# Altium schematic sheet 01-Cover page.SchDoc
size A3; SheetNumber: 1; SheetTotal: 3
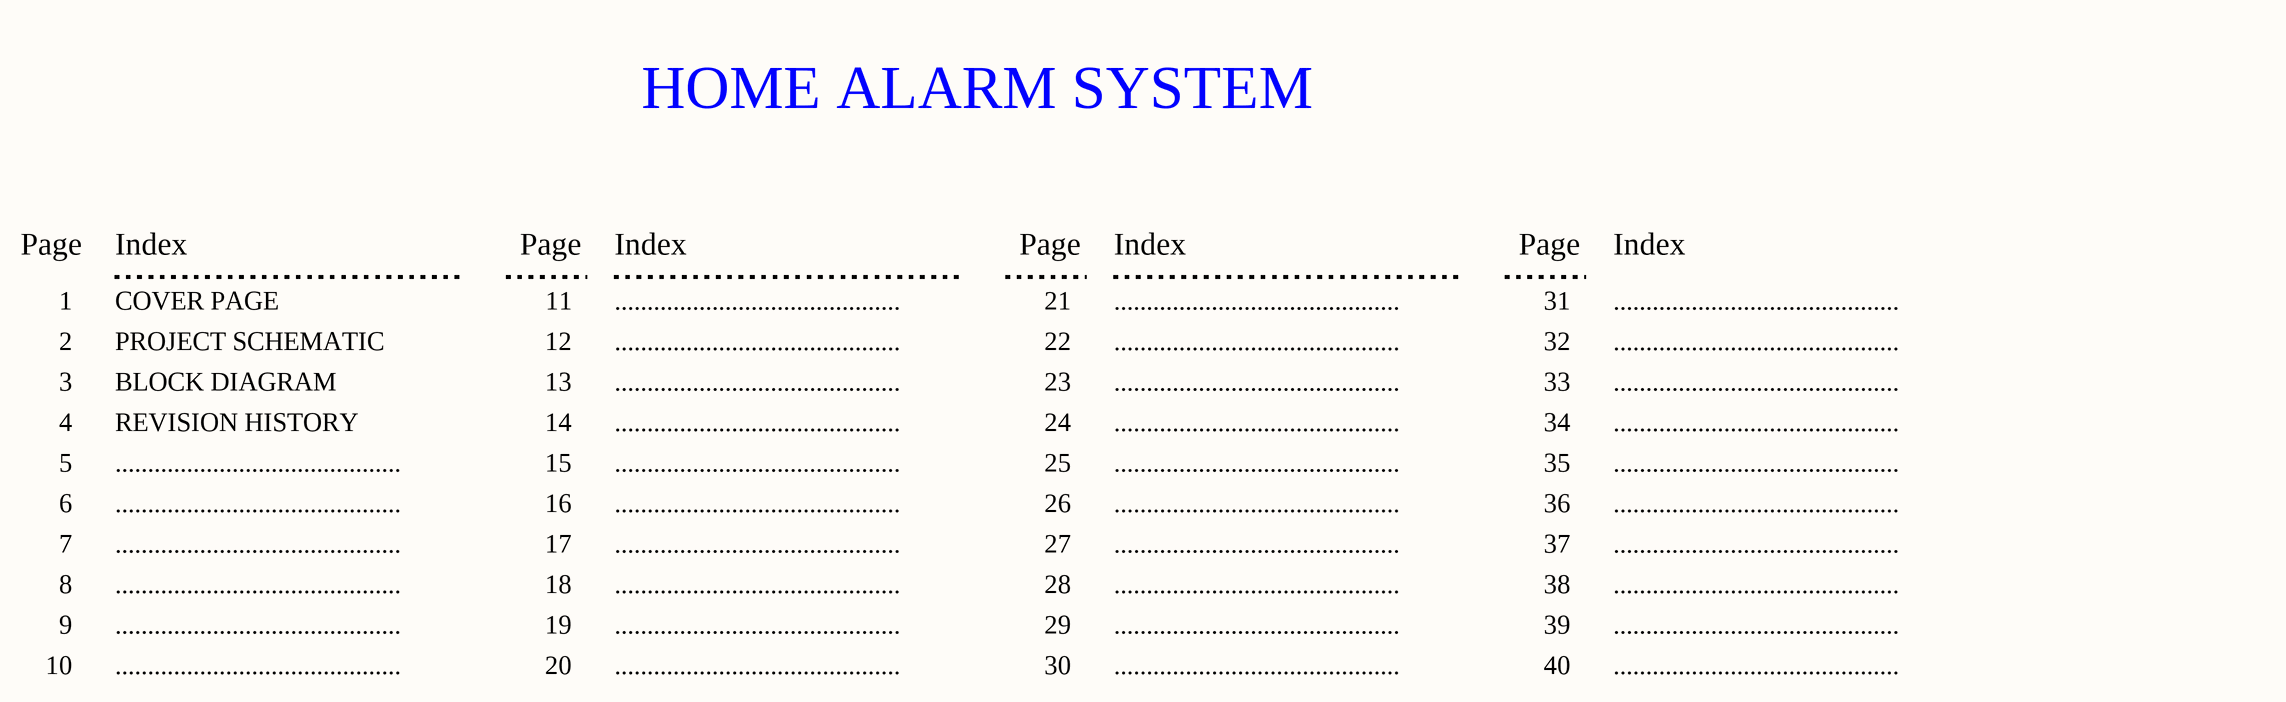
[diagram p0: 01-Cover page.SchDoc]

## Notes on the sheet
- HOME ALARM SYSTEM
- Page
- Index
- 1
- COVER PAGE
- 11
- ............................................
- 21
- 31
- 2
- 3
- BLOCK DIAGRAM
- PROJECT SCHEMATIC
- 12
- 13
- 22
- 23
- 32
- 33
- 4
- 5
- REVISION HISTORY
- 14
- 15
- 24
- 25
- 34
- 35
- 6
- 16
- 26
- 36
- 7
- 8
- 17
- 18
- 27
- 28
- 37
- 38
- 9
- 10
- 19
- 20
- 29
- 30
- 39
- 40